# Altium schematic sheet rad_detector_v500_ANA.SchDoc
size A4; SheetNumber: 7; SheetTotal: 7
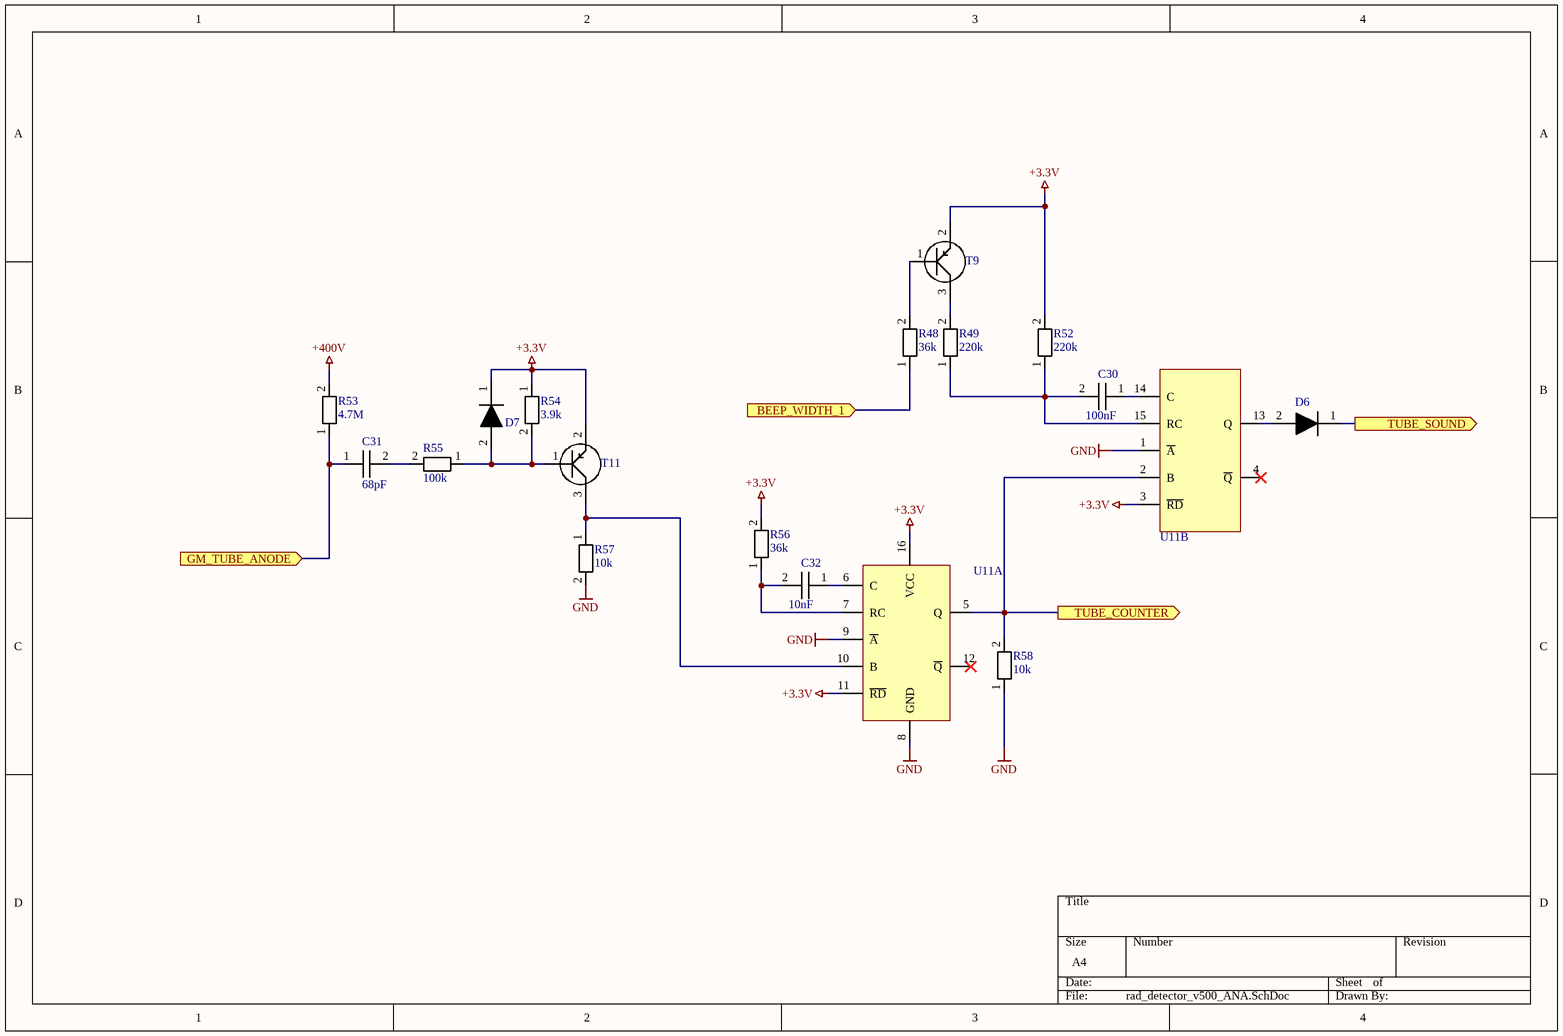
[diagram p0: rad_detector_v500_ANA.SchDoc]

## Parts
C30  100nF  [0805_C]
C31  68pF  [CAPACITOR_250MIL]
C32  10nF  [0805_C]
D6  DIODE  [SMD_DIODE_SOD80]  (value not drawn)
D7  DIODE  [SMD_DIODE_SOD80]  (value not drawn)
R48  36k  [0805]
R49  220k  [0805]
R52  220k  [0805]
R53  4.7M  [0805]
R54  3.9k  [0805]
R55  100k  [0805]
R56  36k  [0805]
R57  10k  [0805]
R58  10k  [0805]
T9  BC856  [SOT23]  (value not drawn)
T11  BC856  [SOT23]  (value not drawn)
U11  74HCT123  [74HCT123]  (value not drawn)  (parts A,B of 2)

## Ports
BEEP_WIDTH_1 (in, see rad_detector_v500_MAIN[2A]), GM_TUBE_ANODE (in, see rad_detector_v500_MAIN[1A]), TUBE_COUNTER (out, see rad_detector_v500_MAIN[1A], rad_detector_v500_MCU[2B]), TUBE_SOUND (out, see rad_detector_v500_MAIN[2A])

## Nets
+3.3V: D7.1 R52.2 R54.1 R56.2 T9.2 T11.2 U11.3(~{RD}) U11.11(~{RD}) U11.16(VCC)
+400V: R53.2
GND: R57.2 R58.1 U11.1(~{A}) U11.8(GND) U11.9(~{A})
BEEP_WIDTH_1: R48.1 ; port BEEP_WIDTH_1
GM_TUBE_ANODE: C31.1 R53.1 ; port GM_TUBE_ANODE
TUBE_COUNTER: R58.2 U11.2(B) U11.5(Q) ; port TUBE_COUNTER
TUBE_SOUND: D6.1 ; port TUBE_SOUND
NetC30_1: C30.1 U11.14(C)
NetC30_2: C30.2 R49.1 R52.1 U11.15(RC)
NetC31_2: C31.2 R55.2
NetC32_1: C32.1 U11.6(C)
NetC32_2: C32.2 R56.1 U11.7(RC)
NetD6_2: D6.2 U11.13(Q)
NetD7_2: D7.2 R54.2 R55.1 T11.1
NetR48_2: R48.2 T9.1
NetR49_2: R49.2 T9.3
NetR57_1: R57.1 T11.3 U11.10(B)

Not connected (* = marked no-connect by the designer): U11 4(~{Q})* 12(~{Q})*

## Library data of the parts
C30-C32 = CAPACITOR
R48 R49 R52-R56 = RESISTOR: Parameter 1: 10k
R57 R58 = RESISTOR: Parameter 1: 10k
T9 T11 = TRANSISTOR_PNP